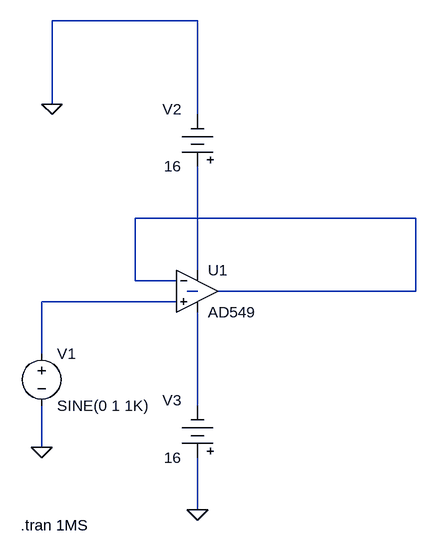
[diagram p0: schematic Draft1.asc]
Draft1.asc, the LTspice schematic file:
Version 4.1
SHEET 1 880 680
WIRE 128 -384 -96 -384
WIRE -96 -256 -96 -384
WIRE 128 -240 128 -384
WIRE 464 -80 32 -80
WIRE 128 0 128 -160
WIRE 32 16 32 -80
WIRE 96 16 32 16
WIRE 128 32 112 32
WIRE 464 32 464 -80
WIRE 464 32 160 32
WIRE 96 48 -112 48
WIRE -112 128 -112 48
WIRE 128 208 128 64
WIRE -112 272 -112 208
WIRE 128 368 128 288
FLAG -112 272 0
FLAG -96 -256 0
FLAG 128 368 0
SYMBOL voltage -112 112 R0
WINDOW 123 0 0 Left 0
WINDOW 39 0 0 Left 0
SYMATTR InstName V1
SYMATTR Value SINE(0 1 1K)
SYMBOL OpAmps\\AD549 128 -32 R0
SYMATTR InstName U1
SYMBOL Misc\\battery 128 -144 R180
WINDOW 0 24 104 Left 2
WINDOW 3 24 16 Left 2
WINDOW 123 0 0 Left 0
WINDOW 39 0 0 Left 0
SYMATTR InstName V2
SYMATTR Value 16
SYMBOL Misc\\battery 128 304 R180
WINDOW 0 24 104 Left 2
WINDOW 3 24 16 Left 2
WINDOW 123 0 0 Left 0
WINDOW 39 0 0 Left 0
SYMATTR InstName V3
SYMATTR Value 16
TEXT -144 392 Left 2 !.tran 1MS

The netlist it stands for:
* Draft1.asc
V1 N004 0 SINE(0 1 1K)
X§U1 N004 N001 N002 N005 N001 AD549  ; pins In+ In- V+ V- OUT
V2 N002 0 16
V3 0 N005 16
.tran 1MS
.backanno
.end